# Altium project IO_Board.PrjPcb
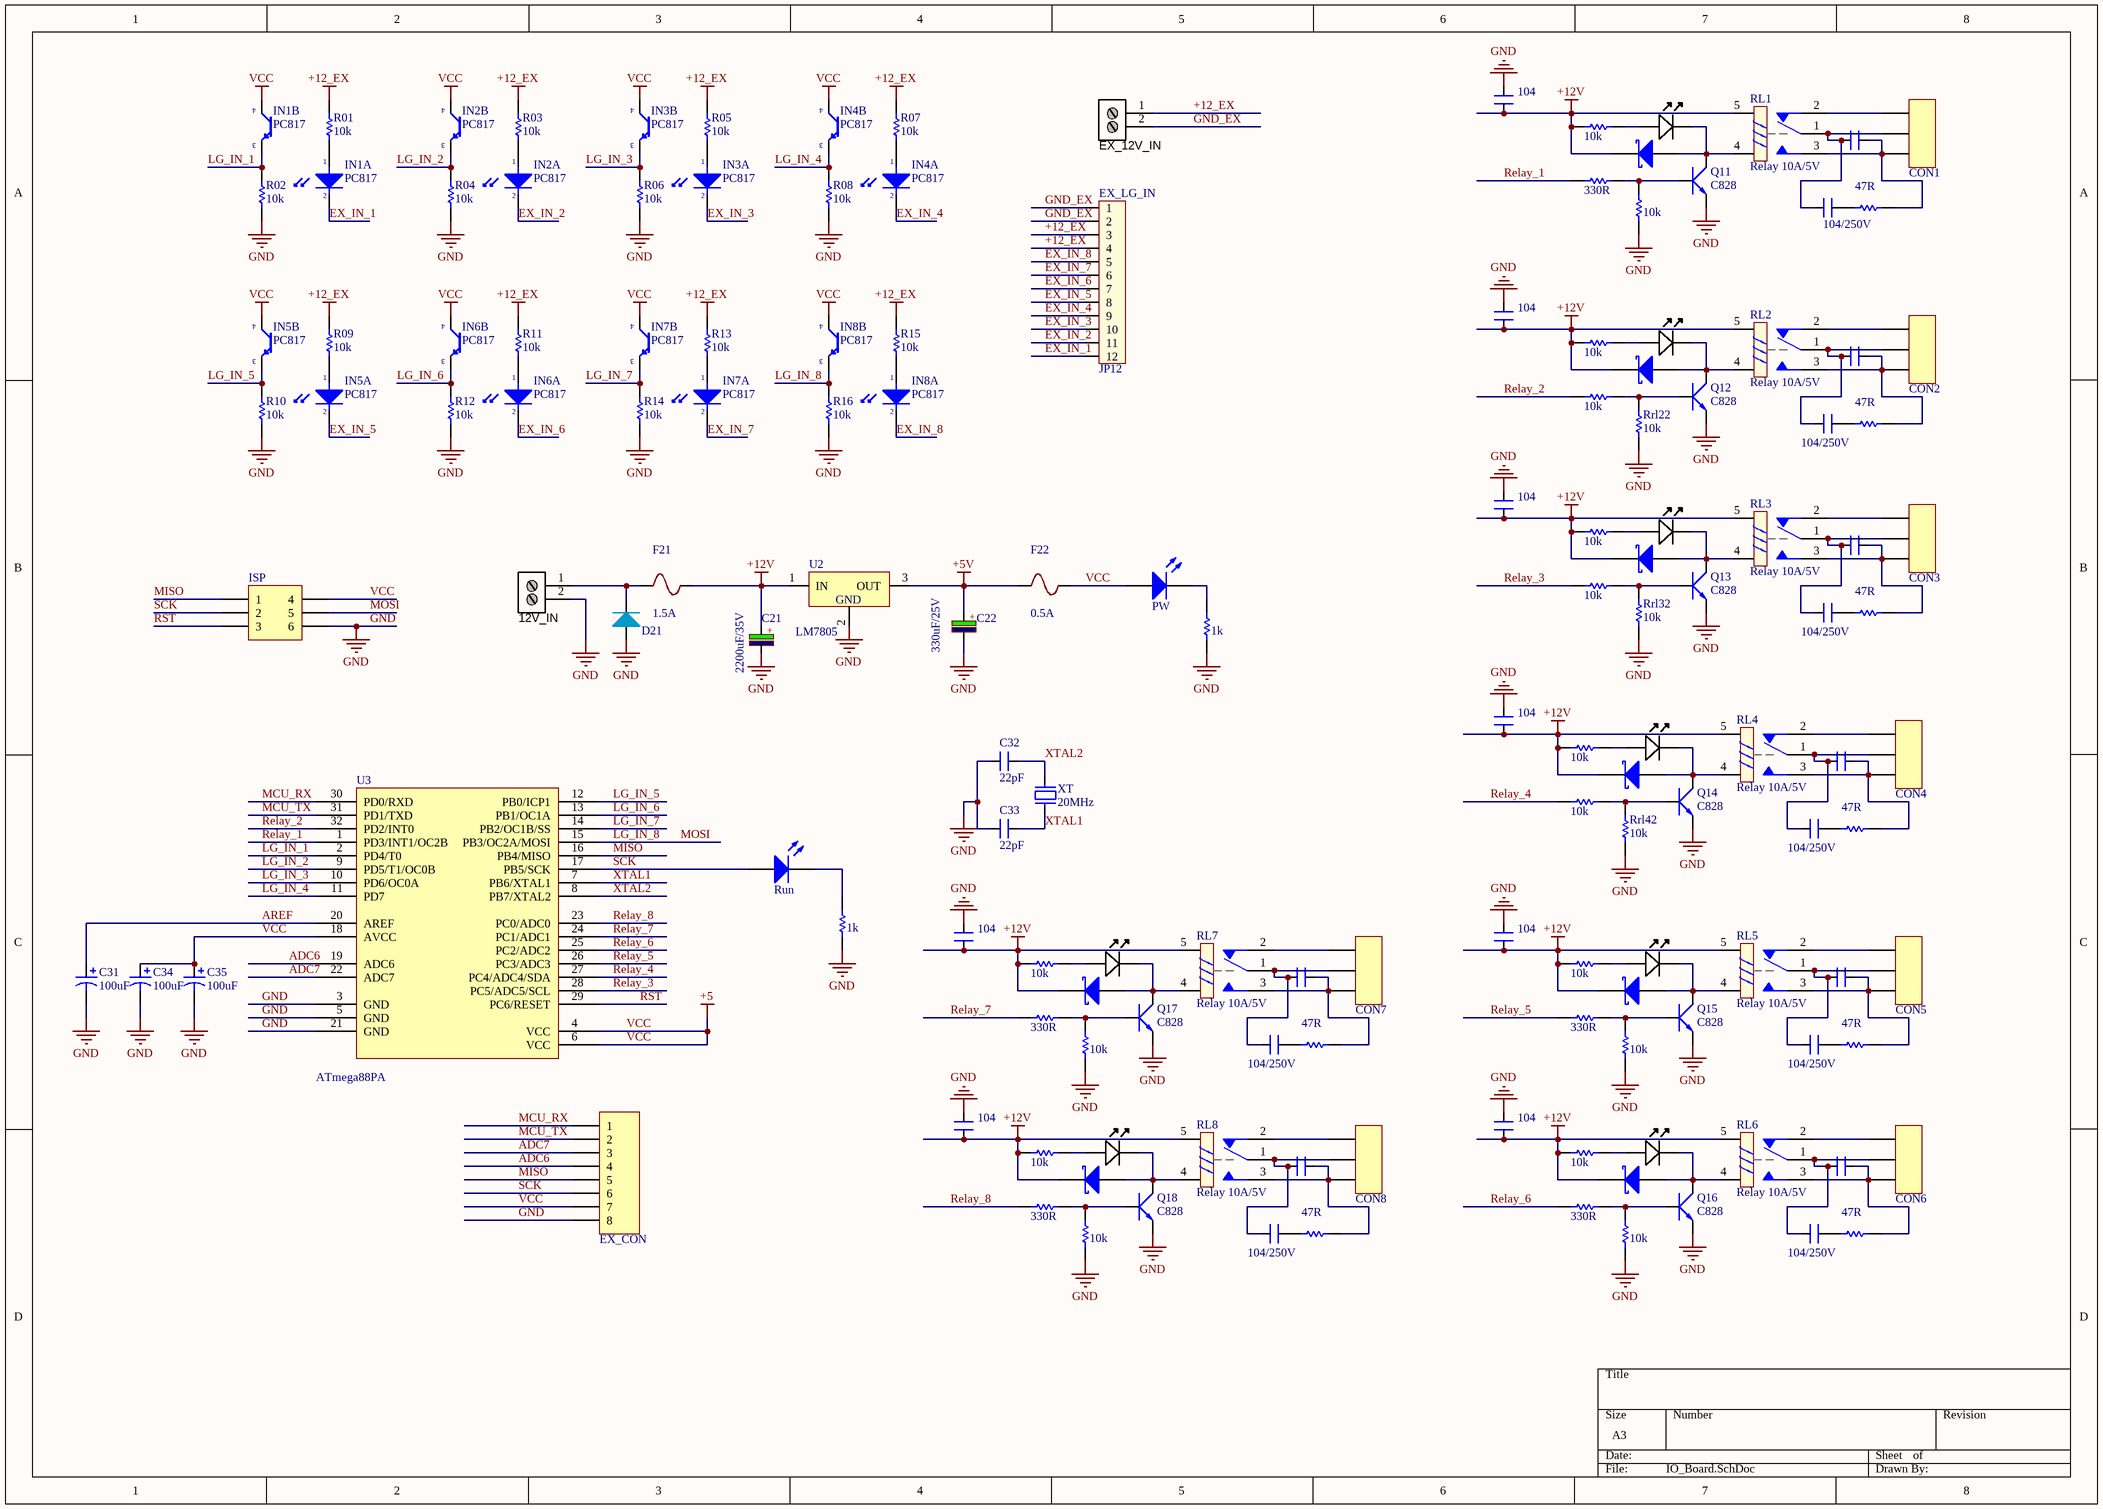
[diagram p0: IO_Board.SchDoc]
1 sheet, 142 parts. Net scope: global (net labels, ports and power ports of the same name join across sheets).
Board file: IO_Board.PcbDoc

## Sheet IO_Board.SchDoc
size A3

### Parts
12V_IN  Stackable ScrewTerm  [2P_PCB_ScrewTerm_200mil]  (value not drawn)
C21  2200uF/35V  [CP_1000uF_25V]
C22  330uF/25V  [CP1.5/3.4]
C31  value 100uF  [CAPC2012N_F]  (hidden comment: Cap)
C32  value 22pF  [CAPC1608N]  (hidden comment: CAP NP)
C33  value 22pF  [CAPC1608N]  (hidden comment: CAP NP)
C34  value 100uF  [CAPC2012N_F]  (hidden comment: Cap)
C35  value 100uF  [CAPC2012N_F]  (hidden comment: Cap)
CON1  3P_ScrewTerm_200mil  [3P_ScrewTerm_200mil]  (value not drawn)
CON2  3P_ScrewTerm_200mil  [3P_ScrewTerm_200mil]  (value not drawn)
CON3  3P_ScrewTerm_200mil  [3P_ScrewTerm_200mil]  (value not drawn)
CON4  3P_ScrewTerm_200mil  [3P_ScrewTerm_200mil]  (value not drawn)
CON5  3P_ScrewTerm_200mil  [3P_ScrewTerm_200mil]  (value not drawn)
CON6  3P_ScrewTerm_200mil  [3P_ScrewTerm_200mil]  (value not drawn)
CON7  3P_ScrewTerm_200mil  [3P_ScrewTerm_200mil]  (value not drawn)
CON8  3P_ScrewTerm_200mil  [3P_ScrewTerm_200mil]  (value not drawn)
Crl1  value 104  [CAPC2012N_F]  (hidden comment: CAP NP)
Crl2  value 104  [CAPC2012N_F]  (hidden comment: CAP NP)
Crl3  value 104  [CAPC2012N_F]  (hidden comment: CAP NP)
Crl4  value 104  [CAPC2012N_F]  (hidden comment: CAP NP)
Crl5  value 104  [CAPC2012N_F]  (hidden comment: CAP NP)
Crl6  value 104  [CAPC2012N_F]  (hidden comment: CAP NP)
Crl7  value 104  [CAPC2012N_F]  (hidden comment: CAP NP)
Crl8  value 104  [CAPC2012N_F]  (hidden comment: CAP NP)
Csub1  value 104/250V  [CAPMF12.5x4.5x9.0x10mmLS]  (hidden comment: CAP NP)
Csub2  value 104/250V  [CAPMF12.5x4.5x9.0x10mmLS]  (hidden comment: CAP NP)
Csub3  value 104/250V  [CAPMF12.5x4.5x9.0x10mmLS]  (hidden comment: CAP NP)
Csub4  value 104/250V  [CAPMF12.5x4.5x9.0x10mmLS]  (hidden comment: CAP NP)
Csub5  value 104/250V  [CAPMF12.5x4.5x9.0x10mmLS]  (hidden comment: CAP NP)
Csub6  value 104/250V  [CAPMF12.5x4.5x9.0x10mmLS]  (hidden comment: CAP NP)
Csub7  value 104/250V  [CAPMF12.5x4.5x9.0x10mmLS]  (hidden comment: CAP NP)
Csub8  value 104/250V  [CAPMF12.5x4.5x9.0x10mmLS]  (hidden comment: CAP NP)
D11  Diode  [DO-214AC]  (value not drawn)
D12  Diode  [DO-214AC]  (value not drawn)
D13  Diode  [DO-214AC]  (value not drawn)
D14  Diode  [DO-214AC]  (value not drawn)
D15  Diode  [DO-214AC]  (value not drawn)
D16  Diode  [DO-214AC]  (value not drawn)
D17  Diode  [DO-214AC]  (value not drawn)
D18  Diode  [DO-214AC]  (value not drawn)
D21  Diode  [Diode 3A]  (value not drawn)
E1  Blue  [LED-0805-A]  (value not drawn)
E2  Blue  [LED-0805-A]  (value not drawn)
E3  Blue  [LED-0805-A]  (value not drawn)
E4  Blue  [LED-0805-A]  (value not drawn)
E5  Blue  [LED-0805-A]  (value not drawn)
E6  Blue  [LED-0805-A]  (value not drawn)
E7  Blue  [LED-0805-A]  (value not drawn)
E8  Blue  [LED-0805-A]  (value not drawn)
EX_12V_IN  Stackable ScrewTerm  [2P_PCB_ScrewTerm_200mil]  (value not drawn)
EX_CON  Header 8  [HDR1X8]  (value not drawn)
EX_LG_IN  JP12  [12P_ScrewTerm_200mil]
F21  1.5A  [FUSE_SR-5-BK]
F22  0.5A  [RESC2012N_ZERO]
IN1  PC817  [DIP4/W0.3]  (parts A,B of 2)
IN2  PC817  [DIP4/W0.3]  (parts A,B of 2)
IN3  PC817  [DIP4/W0.3]  (parts A,B of 2)
IN4  PC817  [DIP4/W0.3]  (parts A,B of 2)
IN5  PC817  [DIP4/W0.3]  (parts A,B of 2)
IN6  PC817  [DIP4/W0.3]  (parts A,B of 2)
IN7  PC817  [DIP4/W0.3]  (parts A,B of 2)
IN8  PC817  [DIP4/W0.3]  (parts A,B of 2)
ISP  Header 3X2A  [HDR2X3_CEN]  (value not drawn)
MOV1  CAP NP  [CAPC500P450250X550]  (value not drawn)
MOV2  CAP NP  [CAPC500P450250X550]  (value not drawn)
MOV3  CAP NP  [CAPC500P450250X550]  (value not drawn)
MOV4  CAP NP  [CAPC500P450250X550]  (value not drawn)
MOV5  CAP NP  [CAPC500P450250X550]  (value not drawn)
MOV6  CAP NP  [CAPC500P450250X550]  (value not drawn)
MOV7  CAP NP  [CAPC500P450250X550]  (value not drawn)
MOV8  CAP NP  [CAPC500P450250X550]  (value not drawn)
PW  Led  [LED 5mm RED]  (value not drawn)
Q11  C828  [SOT23 TOP]
Q12  C828  [SOT23 TOP]
Q13  C828  [SOT23 TOP]
Q14  C828  [SOT23 TOP]
Q15  C828  [SOT23 TOP]
Q16  C828  [SOT23 TOP]
Q17  C828  [SOT23 TOP]
Q18  C828  [SOT23 TOP]
R01  value 10k  [RESC1608N_ZERO]  (hidden comment: Res)
R02  value 10k  [RESC1608N_ZERO]  (hidden comment: Res)
R03  value 10k  [RESC1608N_ZERO]  (hidden comment: Res)
R04  value 10k  [RESC2012N_F]  (hidden comment: Res)
R05  value 10k  [RESC2012N_F]  (hidden comment: Res)
R06  value 10k  [RESC2012N_F]  (hidden comment: Res)
R07  value 10k  [RESC2012N_F]  (hidden comment: Res)
R08  value 10k  [RESC2012N_F]  (hidden comment: Res)
R09  value 10k  [RESC2012N_F]  (hidden comment: Res)
R10  value 10k  [RESC2012N_F]  (hidden comment: Res)
R11  value 10k  [RESC2012N_F]  (hidden comment: Res)
R12  value 10k  [RESC2012N_F]  (hidden comment: Res)
R13  value 10k  [RESC2012N_F]  (hidden comment: Res)
R14  value 10k  [RESC2012N_F]  (hidden comment: Res)
R15  value 10k  [RESC2012N_F]  (hidden comment: Res)
R16  value 10k  [RESC2012N_F]  (hidden comment: Res)
R21  value 1k  [RESC2012N_F]  (hidden comment: Res_0805_1k)
R31  value 1k  [RESC2012N_F]  (hidden comment: Res_0805_1k)
RL1  Relay 10A/5V  [RL_5PIN]
RL2  Relay 10A/5V  [RL_5PIN]
RL3  Relay 10A/5V  [RL_5PIN]
RL4  Relay 10A/5V  [RL_5PIN]
RL5  Relay 10A/5V  [RL_5PIN]
RL6  Relay 10A/5V  [RL_5PIN]
RL7  Relay 10A/5V  [RL_5PIN]
RL8  Relay 10A/5V  [RL_5PIN]
Rl52  value 10k  [RESC1608N_ZERO]  (hidden comment: Res)
Rrl11  value 330R  [RESC1608N_ZERO]  (hidden comment: Res)
Rrl12  value 10k  [RESC1608N_ZERO]  (hidden comment: Res)
Rrl13  value 10k  [RESC1608N_ZERO]  (hidden comment: Res)
Rrl21  value 10k  [RESC1608N_ZERO]  (hidden comment: Res)
Rrl22  value 10k  [RESC1608N_ZERO]  (hidden comment: Res)
Rrl23  value 10k  [RESC1608N_ZERO]  (hidden comment: Res)
Rrl31  value 10k  [RESC1608N_ZERO]  (hidden comment: Res)
Rrl32  value 10k  [RESC1608N_ZERO]  (hidden comment: Res)
Rrl33  value 10k  [RESC1608N_ZERO]  (hidden comment: Res)
Rrl41  value 10k  [RESC1608N_ZERO]  (hidden comment: Res)
Rrl42  value 10k  [RESC1608N_ZERO]  (hidden comment: Res)
Rrl43  value 10k  [RESC1608N_ZERO]  (hidden comment: Res)
Rrl51  value 330R  [RESC1608N_ZERO]  (hidden comment: Res)
Rrl53  value 10k  [RESC1608N_ZERO]  (hidden comment: Res)
Rrl61  value 330R  [RESC1608N_ZERO]  (hidden comment: Res)
Rrl62  value 10k  [RESC1608N_ZERO]  (hidden comment: Res)
Rrl63  value 10k  [RESC1608N_ZERO]  (hidden comment: Res)
Rrl71  value 330R  [RESC1608N_ZERO]  (hidden comment: Res)
Rrl72  value 10k  [RESC1608N_ZERO]  (hidden comment: Res)
Rrl73  value 10k  [RESC1608N_ZERO]  (hidden comment: Res)
Rrl81  value 330R  [RESC1608N_ZERO]  (hidden comment: Res)
Rrl82  value 10k  [RESC1608N_ZERO]  (hidden comment: Res)
Rrl83  value 10k  [RESC1608N_ZERO]  (hidden comment: Res)
Rsub1  value 47R  [RESTH_AXIAL-0.4]  (hidden comment: Res)
Rsub2  value 47R  [RESTH_AXIAL-0.4]  (hidden comment: Res)
Rsub3  value 47R  [RESTH_AXIAL-0.4]  (hidden comment: Res)
Rsub4  value 47R  [RESTH_AXIAL-0.4]  (hidden comment: Res)
Rsub5  value 47R  [RESTH_AXIAL-0.4]  (hidden comment: Res)
Rsub6  value 47R  [RESTH_AXIAL-0.4]  (hidden comment: Res)
Rsub7  value 47R  [RESTH_AXIAL-0.4]  (hidden comment: Res)
Rsub8  value 47R  [RESTH_AXIAL-0.4]  (hidden comment: Res)
Run  Led  [LED 5mm RED]  (value not drawn)
U2  LM7805  [TO-220]
U3  ATmega88PA  [32PIN]
XT  20MHz  [XT2]

### Nets
+5V: C22.1 F22.1 U2.3(OUT)
+12_EX: EX_12V_IN.1 EX_LG_IN.3 EX_LG_IN.4 R01.2 R03.2 R05.2 R07.2 R09.2 R11.2 R13.2 R15.2
+12V: C21.1 Crl1.1 Crl2.1 Crl3.1 Crl4.1 Crl5.1 Crl6.1 Crl7.1 Crl8.1 D11.2(K) D12.2(K) D13.2(K) D14.2(K) D15.2(K) D16.2(K) D17.2(K) D18.2(K) F21.2 RL1.5 RL2.5 RL3.5 RL4.5 RL5.5 RL6.5 RL7.5 RL8.5 Rrl13.2 Rrl23.2 Rrl33.2 Rrl43.2 Rrl53.2 Rrl63.2 Rrl73.2 Rrl83.2 U2.1(IN)
GND: 12V_IN.2 C21.2 C22.2 C31.2 C32.2 C33.2 C34.2 C35.2 Crl1.2 Crl2.2 Crl3.2 Crl4.2 Crl5.2 Crl6.2 Crl7.2 Crl8.2 D21.1(A) EX_CON.8 ISP.6 Q11.3(E) Q12.3(E) Q13.3(E) Q14.3(E) Q15.3(E) Q16.3(E) Q17.3(E) Q18.3(E) R02.1 R04.1 R06.1 R08.1 R10.1 R12.1 R14.1 R16.1 R21.2 R31.2 Rl52.1 Rrl12.1 Rrl22.1 Rrl32.1 Rrl42.1 Rrl62.1 Rrl72.1 Rrl82.1 U2.2 U3.3(GND) U3.5(GND) U3.21(GND)
VCC: C34.1 C35.1 EX_CON.7 F22.2 IN1.4(C) IN2.4(C) IN3.4(C) IN4.4(C) IN5.4(C) IN6.4(C) IN7.4(C) IN8.4(C) ISP.4 PW.1(A) U3.4(VCC) U3.6(VCC) U3.18(AVCC)  [also labelled +5]
ADC6: EX_CON.4 U3.19(ADC6)
ADC7: EX_CON.3 U3.22(ADC7)
AREF: C31.1 U3.20(AREF)
EX_IN_1: EX_LG_IN.12 IN1.2(K)
EX_IN_2: EX_LG_IN.11 IN2.2(K)
EX_IN_3: EX_LG_IN.10 IN3.2(K)
EX_IN_4: EX_LG_IN.9 IN4.2(K)
EX_IN_5: EX_LG_IN.8 IN5.2(K)
EX_IN_6: EX_LG_IN.7 IN6.2(K)
EX_IN_7: EX_LG_IN.6 IN7.2(K)
EX_IN_8: EX_LG_IN.5 IN8.2(K)
GND_EX: EX_12V_IN.2 EX_LG_IN.1 EX_LG_IN.2
LG_IN_1: IN1.3(E) R02.2 U3.2(PD4/T0)
LG_IN_2: IN2.3(E) R04.2 U3.9(PD5/T1/OC0B)
LG_IN_3: IN3.3(E) R06.2 U3.10(PD6/OC0A)
LG_IN_4: IN4.3(E) R08.2 U3.11(PD7)
LG_IN_5: IN5.3(E) R10.2 U3.12(PB0/ICP1)
LG_IN_6: IN6.3(E) R12.2 U3.13(PB1/OC1A)
LG_IN_7: IN7.3(E) R14.2 U3.14(PB2/OC1B/SS)
LG_IN_8: IN8.3(E) ISP.5 R16.2 U3.15(PB3/OC2A/MOSI)  [also labelled MOSI]
MCU_RX: EX_CON.1 U3.30(PD0/RXD)
MCU_TX: EX_CON.2 U3.31(PD1/TXD)
MISO: EX_CON.5 ISP.1 U3.16(PB4/MISO)
Relay_1: Rrl11.1 U3.1(PD3/INT1/OC2B)
Relay_2: Rrl21.1 U3.32(PD2/INT0)
Relay_3: Rrl31.1 U3.28(PC5/ADC5/SCL)
Relay_4: Rrl41.1 U3.27(PC4/ADC4/SDA)
Relay_5: Rrl51.1 U3.26(PC3/ADC3)
Relay_6: Rrl61.1 U3.25(PC2/ADC2)
Relay_7: Rrl71.1 U3.24(PC1/ADC1)
Relay_8: Rrl81.1 U3.23(PC0/ADC0)
RST: ISP.3 U3.29(PC6/RESET)
SCK: EX_CON.6 ISP.2 Run.1(A) U3.17(PB5/SCK)
XTAL1: C33.1 U3.7(PB6/XTAL1) XT.1
XTAL2: C32.1 U3.8(PB7/XTAL2) XT.2
Net12V_IN_1: 12V_IN.1 D21.2(K) F21.1
NetCON1_1: CON1.1 RL1.2
NetCON1_2: CON1.2 Csub1.2 MOV1.2 RL1.1
NetCON1_3: CON1.3 MOV1.1 RL1.3 Rsub1.2
NetCON2_1: CON2.1 RL2.2
NetCON2_2: CON2.2 Csub2.2 MOV2.2 RL2.1
NetCON2_3: CON2.3 MOV2.1 RL2.3 Rsub2.2
NetCON3_1: CON3.1 RL3.2
NetCON3_2: CON3.2 Csub3.2 MOV3.2 RL3.1
NetCON3_3: CON3.3 MOV3.1 RL3.3 Rsub3.2
NetCON4_1: CON4.1 RL4.2
NetCON4_2: CON4.2 Csub4.2 MOV4.2 RL4.1
NetCON4_3: CON4.3 MOV4.1 RL4.3 Rsub4.2
NetCON5_1: CON5.1 RL5.2
NetCON5_2: CON5.2 Csub5.2 MOV5.2 RL5.1
NetCON5_3: CON5.3 MOV5.1 RL5.3 Rsub5.2
NetCON6_1: CON6.1 RL6.2
NetCON6_2: CON6.2 Csub6.2 MOV6.2 RL6.1
NetCON6_3: CON6.3 MOV6.1 RL6.3 Rsub6.2
NetCON7_1: CON7.1 RL7.2
NetCON7_2: CON7.2 Csub7.2 MOV7.2 RL7.1
NetCON7_3: CON7.3 MOV7.1 RL7.3 Rsub7.2
NetCON8_1: CON8.1 RL8.2
NetCON8_2: CON8.2 Csub8.2 MOV8.2 RL8.1
NetCON8_3: CON8.3 MOV8.1 RL8.3 Rsub8.2
NetCsub1_1: Csub1.1 Rsub1.1
NetCsub2_1: Csub2.1 Rsub2.1
NetCsub3_1: Csub3.1 Rsub3.1
NetCsub4_1: Csub4.1 Rsub4.1
NetCsub5_1: Csub5.1 Rsub5.1
NetCsub6_1: Csub6.1 Rsub6.1
NetCsub7_1: Csub7.1 Rsub7.1
NetCsub8_1: Csub8.1 Rsub8.1
NetD11_1: D11.1(A) E1.K Q11.2(C) RL1.4
NetD12_1: D12.1(A) E2.K Q12.2(C) RL2.4
NetD13_1: D13.1(A) E3.K Q13.2(C) RL3.4
NetD14_1: D14.1(A) E4.K Q14.2(C) RL4.4
NetD15_1: D15.1(A) E5.K Q15.2(C) RL5.4
NetD16_1: D16.1(A) E6.K Q16.2(C) RL6.4
NetD17_1: D17.1(A) E7.K Q17.2(C) RL7.4
NetD18_1: D18.1(A) E8.K Q18.2(C) RL8.4
NetE1_A: E1.A Rrl13.1
NetE2_A: E2.A Rrl23.1
NetE3_A: E3.A Rrl33.1
NetE4_A: E4.A Rrl43.1
NetE5_A: E5.A Rrl53.1
NetE6_A: E6.A Rrl63.1
NetE7_A: E7.A Rrl73.1
NetE8_A: E8.A Rrl83.1
NetIN1_1: IN1.1(A) R01.1
NetIN2_1: IN2.1(A) R03.1
NetIN3_1: IN3.1(A) R05.1
NetIN4_1: IN4.1(A) R07.1
NetIN5_1: IN5.1(A) R09.1
NetIN6_1: IN6.1(A) R11.1
NetIN7_1: IN7.1(A) R13.1
NetIN8_1: IN8.1(A) R15.1
NetPW_2: PW.2(K) R21.1
NetQ11_1: Q11.1(B) Rrl11.2 Rrl12.2
NetQ12_1: Q12.1(B) Rrl21.2 Rrl22.2
NetQ13_1: Q13.1(B) Rrl31.2 Rrl32.2
NetQ14_1: Q14.1(B) Rrl41.2 Rrl42.2
NetQ15_1: Q15.1(B) Rl52.2 Rrl51.2
NetQ16_1: Q16.1(B) Rrl61.2 Rrl62.2
NetQ17_1: Q17.1(B) Rrl71.2 Rrl72.2
NetQ18_1: Q18.1(B) Rrl81.2 Rrl82.2
NetR31_1: R31.1 Run.2(K)

### Notes on the sheet
- (in symbol CP4) +
- (in symbol LM78xx) GND

### Library data of the parts
12V_IN EX_12V_IN = 2P_ScrewTerm_90S_3.81MM: Terminal Block Screw Type THT 2-Position 3.81mm pitch; Manufacturer 1: Tyco Electronics; Manufacturer Part Number 1: 1776113-2; Value: 2 position; Pitch: 0.150" (3.81mm); Positions Per Level: 2; Package / Case: Side Entry; 3.81mm pitch; Category: Connectors Interconnects; Color: Black; Supplier 1: Digi-Key; Supplier Part Number 1: A97976-ND
C21 C22 = CP4: Cap 1000uF/16V - 220uF/50V; Description 5: 4,7uF>10uF/250V_3,3uF>10uF/400V - 2,2uF>4,7uF/450V; Description 1: 2200uF-3300uF/6,3V - 1000uF-2200uF/10V; Description 2: 1000uF/16V - 470uF => 1000uF/25V - 100uF/100V; Description 3: 330uF>470uF/35V_220uF>470uF/50V_10uF>22uF/250V; Description 4: 220uF => 330uF/63V - 10uF =>33uF/160 - 200V; Value: 1000uF/16V
D11-D18 = Diode: pin to pad: 1>A 2>K
E1-E8 = LED_SMD_Blue_0805_100mcd: LED 0805 SMD Blue 100mcd 470nm; Manufacturer 1: Ligitek; Manufacturer Part Number 1: LG-170DBKZ-CT; Ratings: 100 mcd; 470 nm; Package / Case: 0805; Material: InGaN/GaN; Value: Blue; Color: Blue
EX_CON = Header 8: Header, 8-Pin; LatestRevisionDate: 17-Jul-2002; LatestRevisionNote: Re-released for DXP Platform.; Publisher: Altium Limited
EX_LG_IN = Con12: Connector 12; Value: Connector 12
F21 F22 = Fuse
IN1-IN8 = Opto
ISP = Header 3X2A: Header, 3-Pin, Dual row; LatestRevisionDate: 17-Jul-2002; LatestRevisionNote: Re-released for DXP Platform.; Publisher: Altium Limited
MOV1-MOV8 = CAP NP: Value: 10pF
PW Run = Led: pin to pad: 1>A 2>K
Q11-Q18 = NPN: Transistor C828 C1815....
R21 R31 = Res
RL1-RL8 = Relay 1: Relay SPDT,10A - 12VDC 5 Pin; Value: Relay SPDT, 10A, 12V
U2 = LM78xx
U3 = ATmega48/168/328
XT = Crystal